# Altium schematic sheet MCU.SchDoc
size A4; Organization: Altium Limited; Address1: L3, 12a Rodborough Rd; Address2: Frenchs Forest; Address3: NSW; Address4: Australia 2086
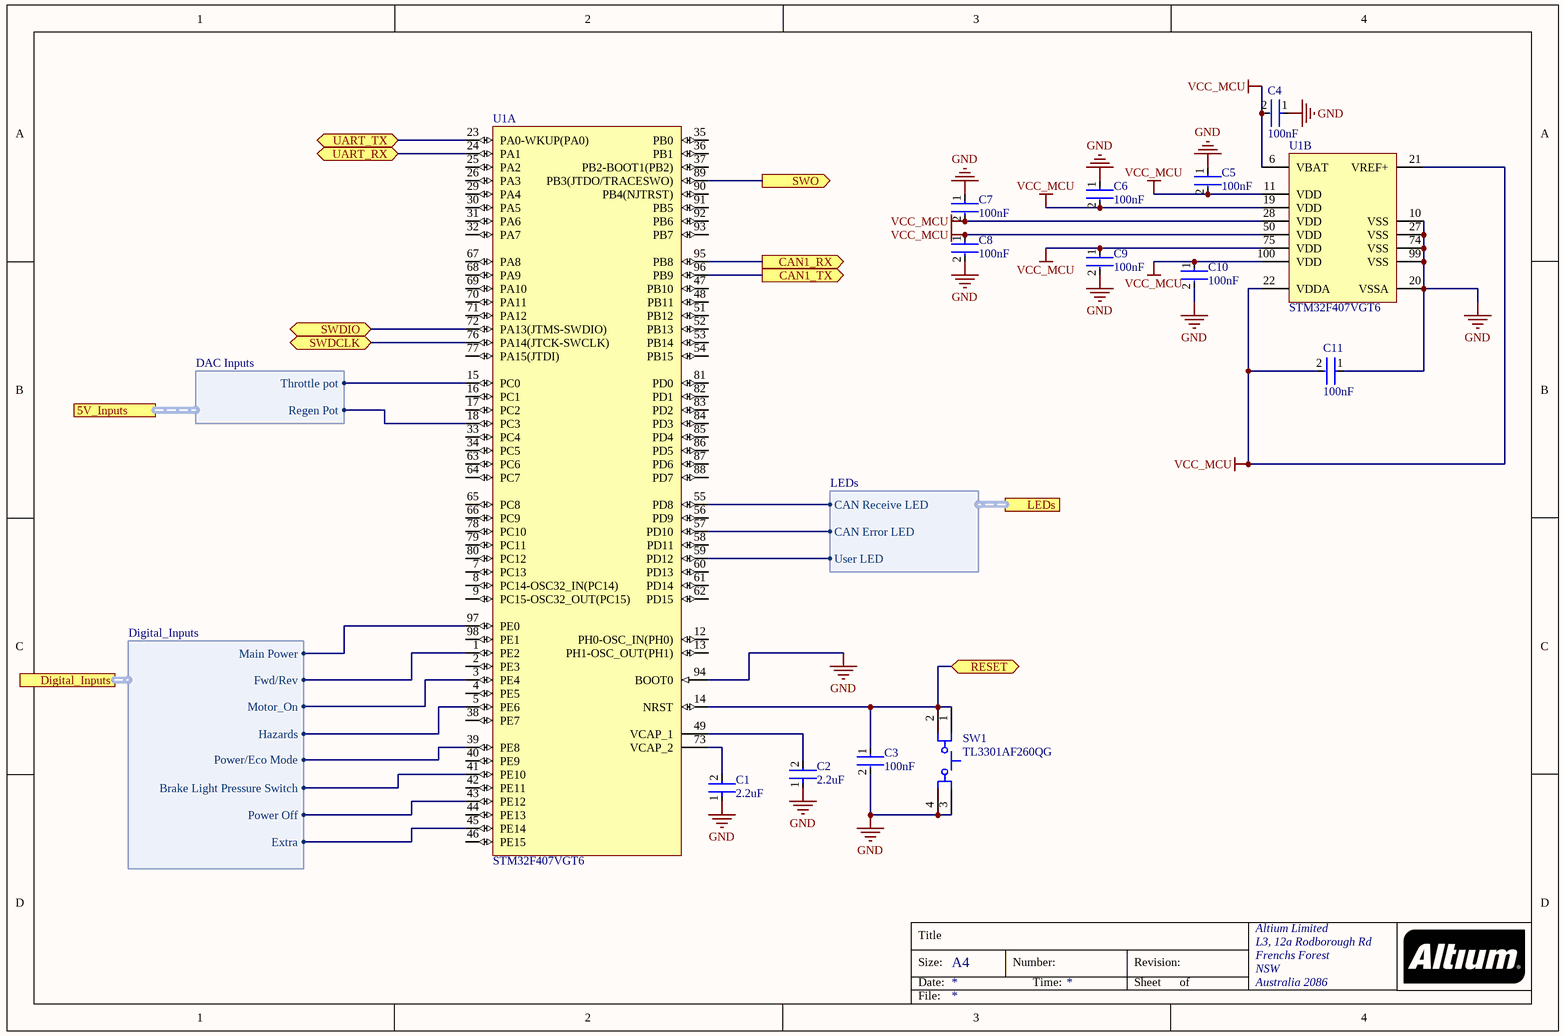
[diagram p0: MCU.SchDoc]

## Parts
C1  2.2uF  [Yageo_CC0805-0.85_IPC_A]
C2  2.2uF  [Yageo_CC0805-0.85_IPC_A]
C3  100nF  [Kemet_C0603_IPC_A]
C4  100nF  [Kemet_C0603_IPC_A]
C5  100nF  [Kemet_C0603_IPC_A]
C6  100nF  [Kemet_C0603_IPC_A]
C7  100nF  [Kemet_C0603_IPC_A]
C8  100nF  [Kemet_C0603_IPC_A]
C9  100nF  [Kemet_C0603_IPC_A]
C10  100nF  [Kemet_C0603_IPC_A]
C11  100nF  [Kemet_C0603_IPC_A]
SW1  TL3301AF260QG  [ESWI-TL3301AF260QG_V]
U1  STM32F407VGT6  [STM-LQFP100_M]  (parts A,B of 2)

## Ports
5V_Inputs (harness DAC Inputs), CAN1_RX (out), CAN1_TX (out), Digital_Inputs (harness Digital_Inputs), LEDs (harness LEDs), RESET (bidir), SWDCLK (bidir), SWDIO (bidir), SWO (out), UART_RX (bidir), UART_TX (bidir)

## Harnesses
DAC Inputs: Throttle pot, Regen Pot
LEDs: CAN Error LED, CAN Receive LED, User LED
Digital_Inputs: Main Power, Fwd/Rev, Motor_On, Hazards, Power/Eco Mode, Brake Light Pressure Switch, Power Off, Extra

## Nets
GND: C1.1 C2.1 C3.2 C4.1 C5.1 C6.1 C7.1 C8.2 C9.2 C10.2 C11.1 SW1.3 SW1.4 U1.10(VSS) U1.20(VSSA) U1.27(VSS) U1.74(VSS) U1.94(BOOT0) U1.99(VSS)
VCC_MCU: C4.2 C5.2 C6.2 C7.2 C8.1 C9.1 C10.1 C11.2 U1.6(VBAT) U1.11(VDD) U1.19(VDD) U1.21(VREF+) U1.22(VDDA) U1.28(VDD) U1.50(VDD) U1.75(VDD) U1.100(VDD)
CAN1_RX: U1.95(PB8) ; port CAN1_RX
CAN1_TX: U1.96(PB9) ; port CAN1_TX
RESET: C3.1 SW1.1 SW1.2 U1.14(NRST) ; port RESET
SWDCLK: U1.76(PA14(JTCK-SWCLK)) ; port SWDCLK
SWDIO: U1.72(PA13(JTMS-SWDIO)) ; port SWDIO
SWO: U1.89(PB3(JTDO/TRACESWO)) ; port SWO
UART_RX: U1.24(PA1) ; port UART_RX
UART_TX: U1.23(PA0-WKUP(PA0)) ; port UART_TX
NetC1_2: C1.2 U1.73(VCAP_2)
NetC2_2: C2.2 U1.49(VCAP_1)
NetU1_1: U1.1(PE2) ; port Digital_Inputs.Fwd/Rev
NetU1_3: U1.3(PE4) ; port Digital_Inputs.Motor_On
NetU1_5: U1.5(PE6) ; port Digital_Inputs.Hazards
NetU1_15: U1.15(PC0) ; port 5V_Inputs.Throttle pot
NetU1_18: U1.18(PC3) ; port 5V_Inputs.Regen Pot
NetU1_39: U1.39(PE8) ; port Digital_Inputs.Power/Eco Mode
NetU1_41: U1.41(PE10) ; port Digital_Inputs.Brake Light Pressure Switch
NetU1_43: U1.43(PE12) ; port Digital_Inputs.Power Off
NetU1_45: U1.45(PE14) ; port Digital_Inputs.Extra
NetU1_55: U1.55(PD8) ; port LEDs.CAN Receive LED
NetU1_57: U1.57(PD10) ; port LEDs.CAN Error LED
NetU1_59: U1.59(PD12) ; port LEDs.User LED
NetU1_97: U1.97(PE0) ; port Digital_Inputs.Main Power

Not connected (* = marked no-connect by the designer): U1 2(PE3) 4(PE5) 7(PC13) 8(PC14-OSC32_IN(PC14)) 9(PC15-OSC32_OUT(PC15)) 12(PH0-OSC_IN(PH0)) 13(PH1-OSC_OUT(PH1)) 16(PC1) 17(PC2) 25(PA2) 26(PA3) 29(PA4) 30(PA5) 31(PA6) 32(PA7) 33(PC4) 34(PC5) 35(PB0) 36(PB1) 37(PB2-BOOT1(PB2)) 38(PE7) 40(PE9) 42(PE11) 44(PE13) 46(PE15) 47(PB10) 48(PB11) 51(PB12) 52(PB13) 53(PB14) 54(PB15) 56(PD9) 58(PD11) 60(PD13) 61(PD14) 62(PD15) 63(PC6) 64(PC7) 65(PC8) 66(PC9) 67(PA8) 68(PA9) 69(PA10) 70(PA11) 71(PA12) 77(PA15(JTDI)) 78(PC10) 79(PC11) 80(PC12) 81(PD0) 82(PD1) 83(PD2) 84(PD3) 85(PD4) 86(PD5) 87(PD6) 88(PD7) 90(PB4(NJTRST)) 91(PB5) 92(PB6) 93(PB7) 98(PE1)

## Notes on the sheet
- Title
- Size:
- Date:
- A4
- Number:
- Time:
- Revision:
- Sheet
- of
- File:

## Library data of the parts
C1 C2 = CC0805KKX7R6BB225: 2.2UF CC0805KKX7R6BB225
C3-C11 = C0603C104K5RACTU: CAP CER 0.1UF 100NF 50V X7R 0603 C0603C104K5RACTU
SW1 = CMP-2000-07249-1: Tactile Switch, SPST-NO, 50 mA, 12 V, -20 to 70 degC, 4-Pin SMD, RoHS, Tape and Reel; Manufacturer: E-Switch; Catalog Drawings: TL3301xFFootprint; Contact Rating @ Voltage: 0.05A@12VDC; Featured Product: TL3301SeriesTactSwitch; Mechanical Life: 100,000Cycles; Product Training Modules: SwitchBasics; Actuator Orientation: TopActuated; Switch Travel: 0.25mm; Other Names: EG2527DKR; 3D Model: TL3301AFyyyyG.stp; Illumination: Non-Illuminated; Switch Function: Off-Mom; Online Catalog: TL3301Series; Outline: 6.00mmx6.00mm; Package Version: Rev. D, 10/2014; Operating Force: 260gf; Actuator Material: Polyamide(PA),Nylon; Actuator Type: Standard; Actuator Height off PCB, from Pins: 5.00mm; Packaging: Digi-Reel®; Standard Package: 1; Datasheet URL: https://www.e-switch.com/system/asset/product_line/data_sheet/185/TL3301.pdf; Family: TactileSwitches; Mounting Technology: SurfaceMount; Illumination Type, Color: -; Manufacturer URL: http://www.e-switch.ch/en/; RoHS Information: TL3301SeriesRoHSCertofCompliance; Ingress Protection: -; Package URL: http://spec_sheets.e-switch.com/specs/P010513.pdf; Illumination Voltage (Nominal): -; Operating Temperature: -20°C~70°C; Series: TL3301; Termination Style: GullWing; Category: Switches; Mounting Type: SurfaceMount; Package Description: 4-Pin Surface Mount Device, Body 6 x 6 mm; Features: -; Circuit: SPST-NO; Package Reference: TL3301AF260QG; Datasheet Version: 12/2013
U1 = CMP-0243-00017-3: ARM Cortex-M4 32-bit MCU+FPU, 210 DMIPS, 1024 kB Flash, 192 kB Internal RAM, 82 I/Os, 100-pin LQFP, -40 to 85 degC, Tray; Manufacturer: STMicroelectronics; Supply Voltage(Vcc) min (V): 1.8; Supply Voltage(Vcc) max (V): 3.6; I/Os (High Current): 82; Operating Frequency(F) (Processor speed) (MHz): 168; D/A Converter: 2x12-bit; FLASH Size (Prog) (kB): 1024; Internal RAM Size (kB): 192; PackageDescription: 100-Pin Low Profile Quad Flat Package, 14 x 14 mm Body, 0.5 mm Pitch; ComponentLink3URL: http://www.st.com/st-web-ui/static/active/en/resource/technical/document/data_brief/DM00071938.pdf; PackageVersion: Rev. 1, 06/2013; PackageReference: LQFP100; PartNumber: STM32F407VGT6; ComponentLink1Description: Manufacturer URL; ComponentLink2URL: http://www.st.com/st-web-ui/static/active/en/resource/technical/document/datasheet/DM00037051.pdf; DatasheetVersion: Rev. 4; ComponentLink3Description: Package Specification; Core: ARM Cortex-M4; ComponentLink2Description: Datasheet; Mounting Technology: Surface Mount; ComponentLink1URL: http://www.st.com/web/en/home.html; Packing: Tray